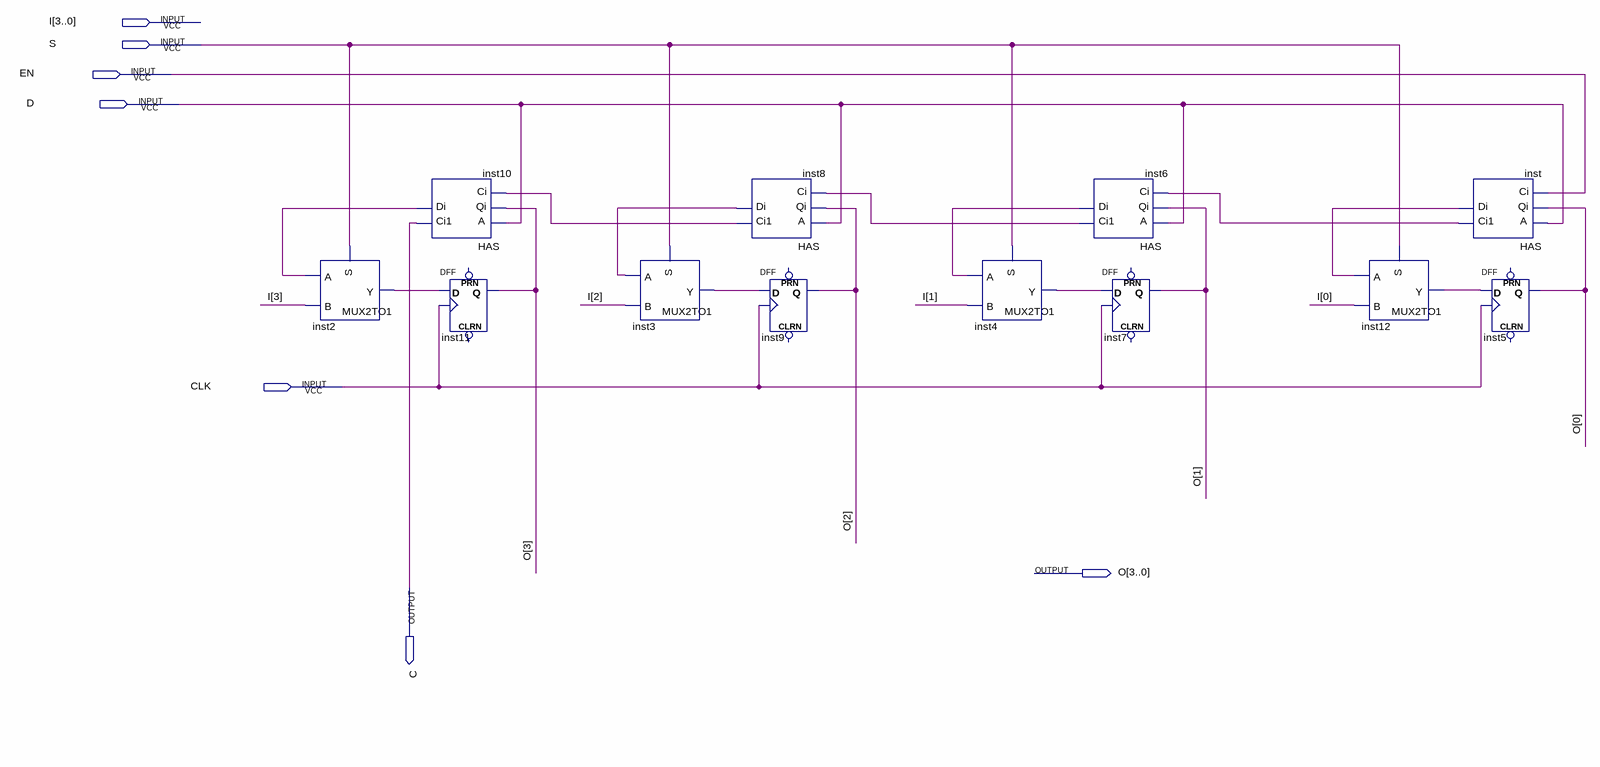
[diagram p0: schematic sheet]
// Quartus schematic UPDOWNCOUNTER4BITLOAD.bdf as structural Verilog: 12 symbols, 7 pins
module UPDOWNCOUNTER4BITLOAD (
  input  [3:0] I,
  input  S,
  input  EN,
  input  D,
  input  CLK,
  output [3:0] O,
  output C
);

  wire inst2_y, inst3_y, inst4_y, inst6_ci1, inst6_di, inst8_ci1, inst8_di, inst10_di, inst12_y, inst_ci1,
       inst_di;

  MUX2TO1 inst2 (.S(S), .A(inst10_di), .B(I[3]), .Y(inst2_y));
  HAS inst10 (.A(D), .Qi(O[3]), .Ci(inst8_ci1), .Ci1(C), .Di(inst10_di));
  DFF inst11 (.CLK(CLK), .D(inst2_y), .Q(O[3]));  // open: CLRN, PRN
  MUX2TO1 inst3 (.S(S), .A(inst8_di), .B(I[2]), .Y(inst3_y));
  HAS inst8 (.A(D), .Qi(O[2]), .Ci(inst6_ci1), .Ci1(inst8_ci1), .Di(inst8_di));
  DFF inst9 (.CLK(CLK), .D(inst3_y), .Q(O[2]));  // open: CLRN, PRN
  MUX2TO1 inst4 (.S(S), .A(inst6_di), .B(I[1]), .Y(inst4_y));
  HAS inst6 (.A(D), .Qi(O[1]), .Ci(inst_ci1), .Ci1(inst6_ci1), .Di(inst6_di));
  DFF inst7 (.CLK(CLK), .D(inst4_y), .Q(O[1]));  // open: CLRN, PRN
  MUX2TO1 inst12 (.S(S), .A(inst_di), .B(I[0]), .Y(inst12_y));
  HAS inst (.A(D), .Qi(O[0]), .Ci(EN), .Ci1(inst_ci1), .Di(inst_di));
  DFF inst5 (.CLK(CLK), .D(inst12_y), .Q(O[0]));  // open: CLRN, PRN
endmodule
